# Altium schematic sheet Sheet2.SchDoc: =GlobalProjectName
size 410 x 297 mm; ApprovedBy: Утвердил; CheckedBy: Проверил; Author: Разработал; SheetNumber: 1; SheetTotal: 1; PageSetup: Record=PageOptions|CenterHorizontal=True|CenterVertical=True|PrintScale=1.00|XCorrection=1.00|YCorrection=1.00|PrintKind=1|BorderSize=5000000|LeftOffset=0|BottomOffset=0|Orientation=2|PaperLength=1000|PaperWidth=1000|Scale=100|PaperSource=15|PrintQuality=1200|MediaType=1|DitherType=10|PaperKind=A3|PrintScaleMode=1; Weight: -; ScaleFactor: -; NormInspection: Норм.Контр.
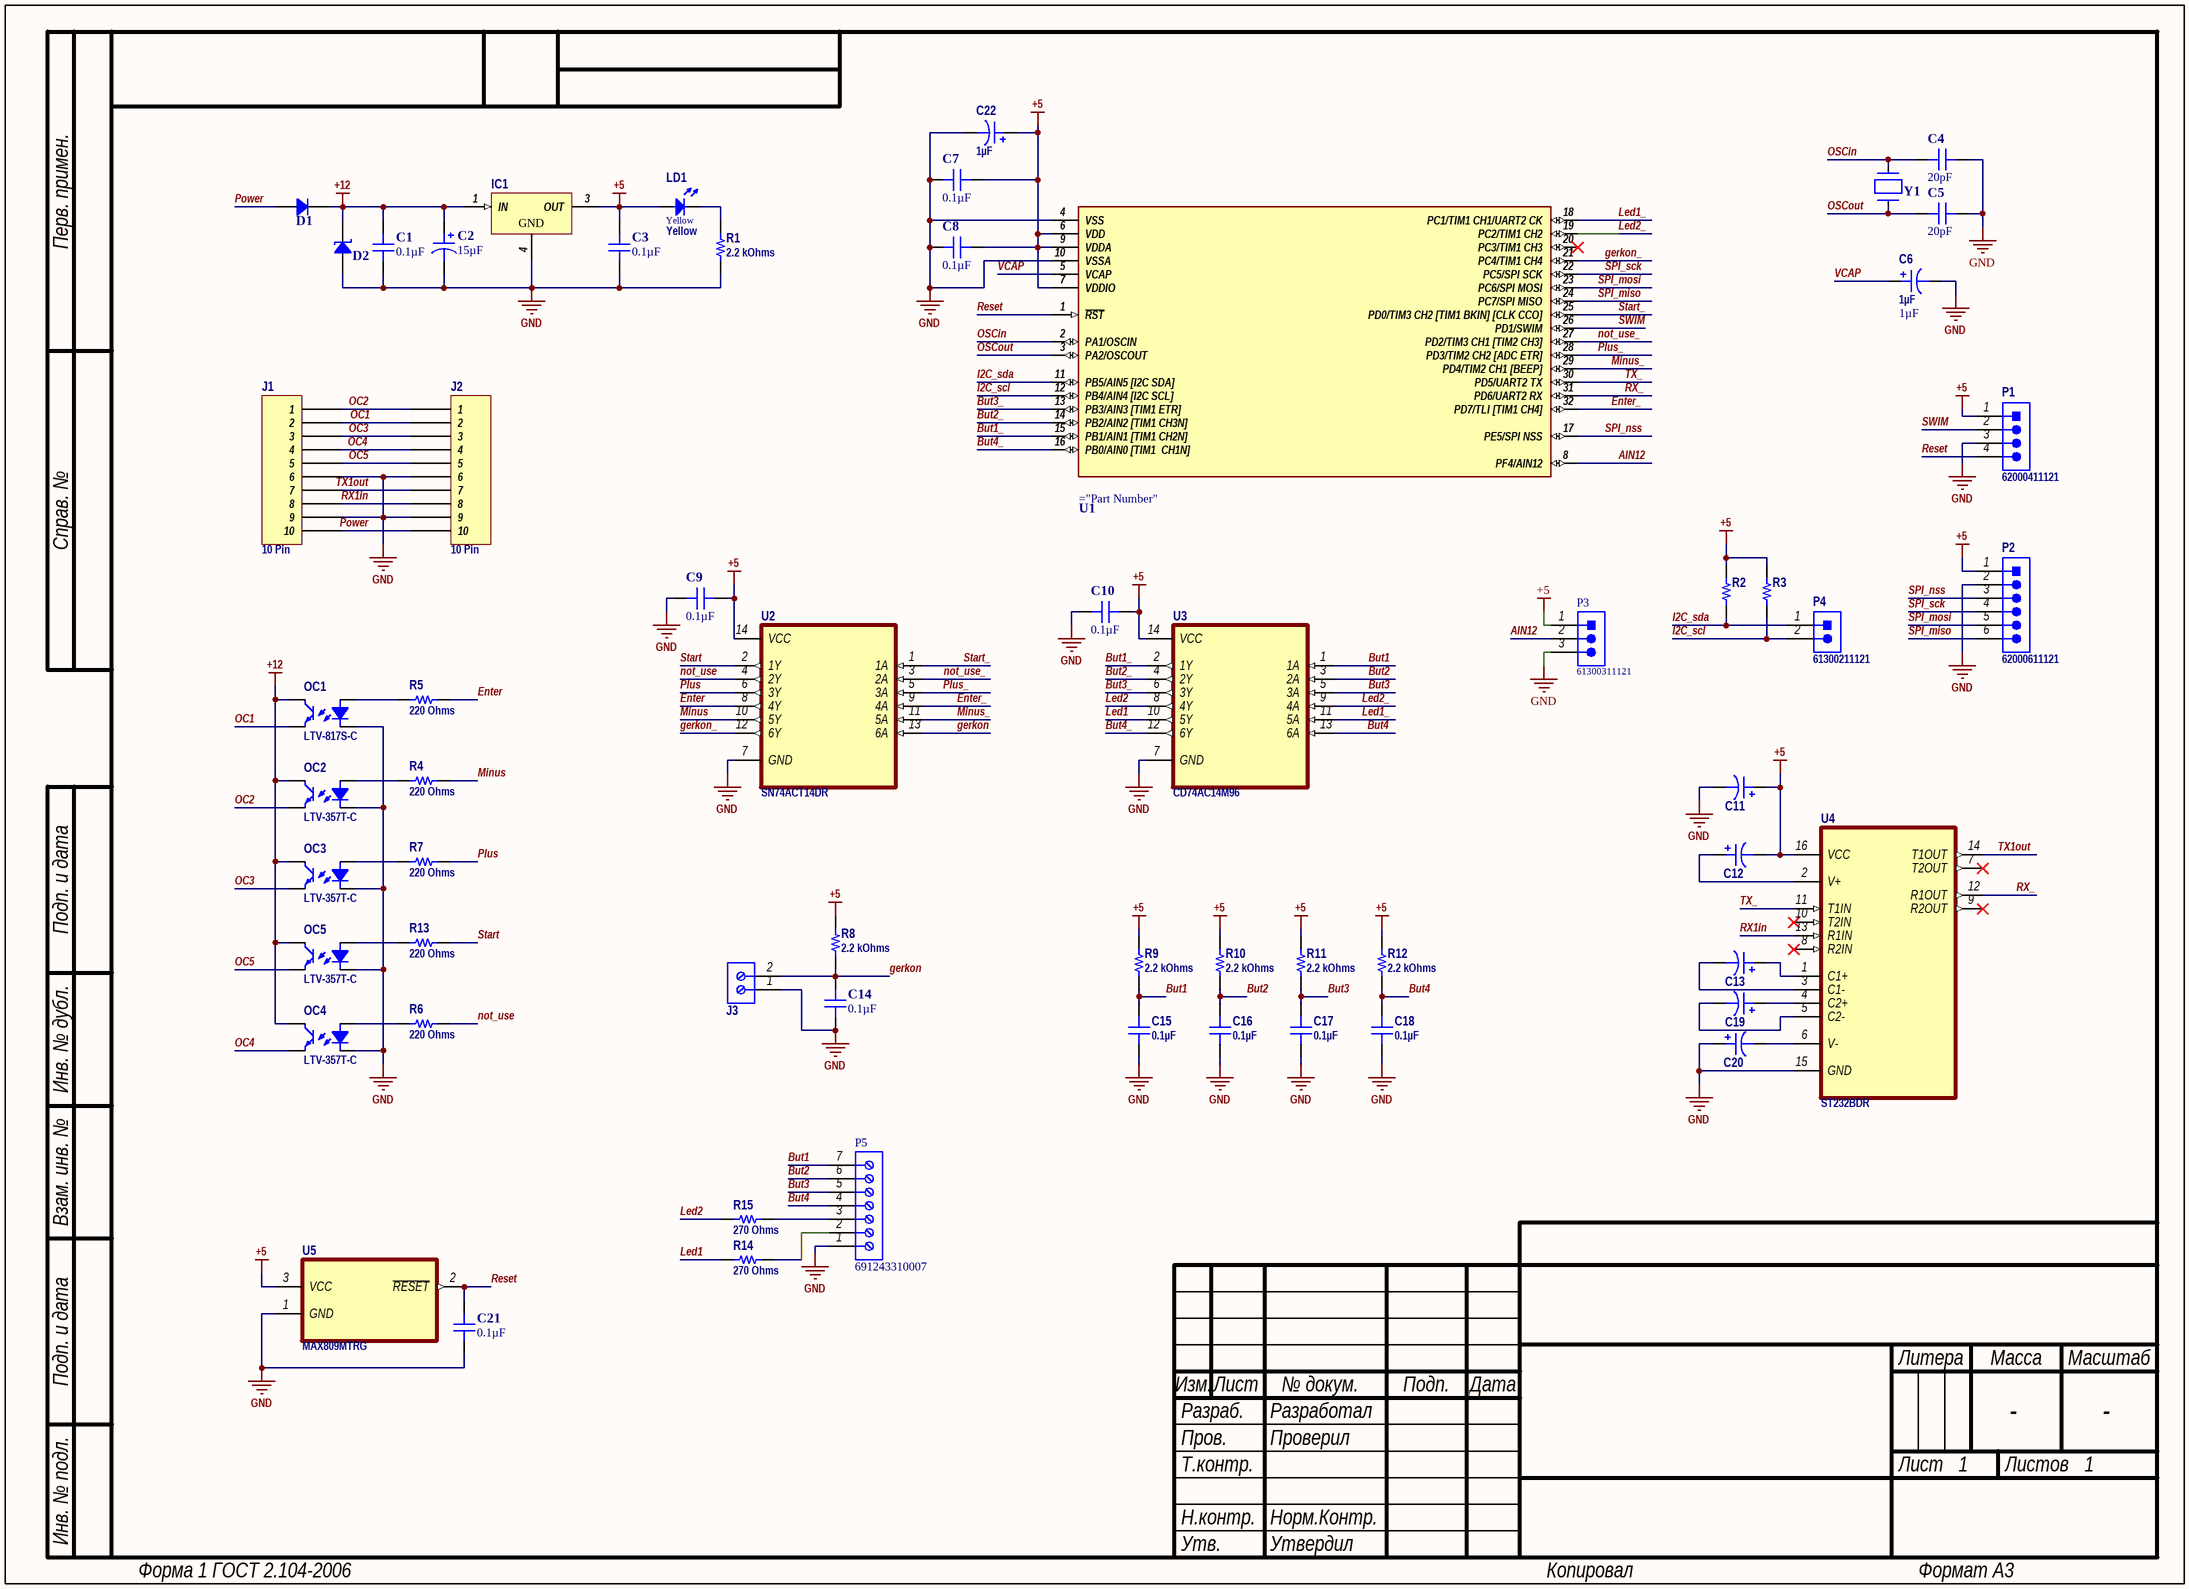
[diagram p0: Sheet2.SchDoc]

## Parts
C1  0.1µF  [CAP 0603_1608]
C2  15µF  [CAP POL 2917_7343]
C3  0.1µF  [CAP 0603_1608]
C4  20pF  [CAP 0603_1608]
C5  20pF  [CAP 0603_1608]
C6  1µF  [CAP POL 1206_3216]
C7  0.1µF  [CAP 0603_1608]
C8  0.1µF  [CAP 0603_1608]
C9  0.1µF  [CAP 0603_1608]
C10  0.1µF  [CAP 0603_1608]
C11  0.47µF  [CAP POL 1206_3216]  (value not drawn)
C12  0.47µF  [CAP POL 1206_3216]  (value not drawn)
C13  0.47µF  [CAP POL 1206_3216]  (value not drawn)
C14  0.1µF  [CAP 0603_1608]
C15  0.1µF  [CAP 0402_1005]
C16  0.1µF  [CAP 0402_1005]
C17  0.1µF  [CAP 0402_1005]
C18  0.1µF  [CAP 0402_1005]
C19  0.47µF  [CAP POL 1206_3216]  (value not drawn)
C20  0.47µF  [CAP POL 1206_3216]  (value not drawn)
C21  0.1µF  [CAP 0603_1608]
C22  1µF  [CAP POL 1206_3216]
D1  SS24FL  [SOD-123W]  (value not drawn)
D2  SMBJ15CA-E3/52  [DO214AA SMB]  (value not drawn)
IC1  MC7805BDTG  [TO-252AA]  (value not drawn)
J1  10 Pin  [CON: IDC-10MS - 1_7mm]
J2  10 Pin  [CON: IDC-10MS - 1_7mm]
J3  691103110002  [691103110002]  (value not drawn)
LD1  Yellow  [LED_KINGBRIGHT_KPH-1608YC]
OC1  LTV-817S-C  [LITEON LTV-817]
OC2  LTV-357T-C  [LITEON LTV-357T]
OC3  LTV-357T-C  [LITEON LTV-357T]
OC4  LTV-357T-C  [LITEON LTV-357T]
OC5  LTV-357T-C  [LITEON LTV-357T]
P1  62000411121  [62000411121]
P2  62000611121  [62000611121]
P3  61300311121  [61300311121]
P4  61300211121  [61300211121]
P5  691243310007  [691243310007]
R1  2.2 kOhms  [RES 0603_1608]
R2  2.2 kOhms  [RES 0603_1608]  (value not drawn)
R3  2.2 kOhms  [RES 0603_1608]  (value not drawn)
R4  220 Ohms  [RES 0603_1608]
R5  220 Ohms  [RES 0603_1608]
R6  220 Ohms  [RES 0603_1608]
R7  220 Ohms  [RES 0603_1608]
R8  2.2 kOhms  [RES 0603_1608]
R9  2.2 kOhms  [RES 0603_1608]
R10  2.2 kOhms  [RES 0603_1608]
R11  2.2 kOhms  [RES 0603_1608]
R12  2.2 kOhms  [RES 0603_1608]
R13  220 Ohms  [RES 0603_1608]
R14  270 Ohms  [RES 0805_2012]
R15  270 Ohms  [RES 0805_2012]
U1  STM8S005K6T6C  [STMicroelectronics_LQFP32-5V_0]  (value not drawn)
U2  SN74ACT14DR  [14-SOIC]
U3  CD74AC14M96  [SOIC127P600X175-14N]
U4  ST232BDR  [16-SO]
U5  MAX809MTRG  [SOT95P240X111-3N]
Y1  Crys_Abracon_ABL-16.000MHZ-B2_eec  [Abracon_ABL-16.000MHZ-B2_0]  (value not drawn)

## Nets
+5: C3.2 C7.2 C8.1 C9.1 C10.1 C11.1 C12.2 C22.1 IC1.3(OUT) LD1.2(A) P1.1 P2.1 P3.1 R2.2 R3.2 R8.2 R9.2 R10.2 R11.2 R12.2 U1.6(VDD) U1.7(VDDIO) U1.9(VDDA) U2.14(VCC) U3.14(VCC) U4.16(VCC) U5.3(VCC)
+12: C1.2 C2.1 D1.2 D2.2 IC1.1(IN) OC1.4 OC2.4 OC3.4 OC4.4 OC5.4
GND: C1.1 C2.2 C3.1 C4.1 C5.1 C6.2 C7.1 C8.2 C9.2 C10.2 C11.2 C14.1 C15.1 C16.1 C17.1 C18.1 C20.1 C21.1 C22.2 D2.1 IC1.4(GND) J1.6 J1.9 J2.6 J2.9 J3.1 OC1.2 OC2.2 OC3.2 OC4.2 OC5.2 P1.3 P2.2 P3.3 P5.1 R1.1 U1.4(VSS) U1.10(VSSA) U2.7(GND) U3.7(GND) U4.15(GND) U5.1(GND)
AIN12: P3.2 U1.8(PF4/AIN12)
But1: C15.2 P5.7 R9.1 U3.1(1A)
But1_: U1.15(PB1/AIN1_[TIM1_CH2N]) U3.2(1Y)
But2: C16.2 P5.6 R10.1 U3.3(2A)
But2_: U1.14(PB2/AIN2_[TIM1_CH3N]) U3.4(2Y)
But3: C17.2 P5.5 R11.1 U3.5(3A)
But3_: U1.13(PB3/AIN3_[TIM1_ETR]) U3.6(3Y)
But4: C18.2 P5.4 R12.1 U3.13(6A)
But4_: U1.16(PB0/AIN0_[TIM1__CH1N]) U3.12(6Y)
Enter: R5.2 U2.8(4Y)
Enter_: U1.32(PD7/TLI_[TIM1_CH4]) U2.9(4A)
gerkon: C14.2 J3.2 R8.1 U2.13(6A)
gerkon_: U1.21(PC4/TIM1_CH4) U2.12(6Y)
I2C_scl: P4.2 R3.1 U1.12(PB4/AIN4_[I2C_SCL])
I2C_sda: P4.1 R2.1 U1.11(PB5/AIN5_[I2C_SDA])
Led1: R14.1 U3.10(5Y)
Led1_: U1.18(PC1/TIM1_CH1/UART2_CK) U3.11(5A)
Led2: R15.1 U3.8(4Y)
Led2_: U1.19(PC2/TIM1_CH2) U3.9(4A)
Minus: R4.2 U2.10(5Y)
Minus_: U1.29(PD4/TIM2_CH1_[BEEP]) U2.11(5A)
not_use: R6.2 U2.4(2Y)
not_use_: U1.27(PD2/TIM3_CH1_[TIM2_CH3]) U2.3(2A)
OC1: J1.2 J2.2 OC1.3
OC2: J1.1 J2.1 OC2.3
OC3: J1.3 J2.3 OC3.3
OC4: J1.4 J2.4 OC4.3
OC5: J1.5 J2.5 OC5.3
OSCin: C4.2 U1.2(PA1/OSCIN) Y1.1
OSCout: C5.2 U1.3(PA2/OSCOUT) Y1.2
Plus: R7.2 U2.6(3Y)
Plus_: U1.28(PD3/TIM2_CH2_[ADC_ETR]) U2.5(3A)
Power: D1.1 J1.10 J2.10
Reset: C21.2 P1.4 U1.1(~{RST}) U5.2(~{RESET})
RX1in: J1.8 J2.8 U4.13(R1IN)
RX_: U1.31(PD6/UART2_RX) U4.12(R1OUT)
SPI_miso: P2.6 U1.24(PC7/SPI_MISO)
SPI_mosi: P2.5 U1.23(PC6/SPI_MOSI)
SPI_nss: P2.3 U1.17(PE5/SPI_NSS)
SPI_sck: P2.4 U1.22(PC5/SPI_SCK)
Start: R13.2 U2.2(1Y)
Start_: U1.25(PD0/TIM3_CH2_[TIM1_BKIN]_[CLK_CCO]) U2.1(1A)
SWIM: P1.2 U1.26(PD1/SWIM)
TX1out: J1.7 J2.7 U4.14(T1OUT)
TX_: U1.30(PD5/UART2_TX) U4.11(T1IN)
VCAP: C6.1 U1.5(VCAP)
NetC12_1: C12.1 U4.2(V+)
NetC13_1: C13.1 U4.1(C1+)
NetC13_2: C13.2 U4.3(C1-)
NetC19_1: C19.1 U4.4(C2+)
NetC19_2: C19.2 U4.5(C2-)
NetC20_2: C20.2 U4.6(V-)
NetLD1_1: LD1.1(C) R1.2
NetOC1_1: OC1.1 R5.1
NetOC2_1: OC2.1 R4.1
NetOC3_1: OC3.1 R7.1
NetOC4_1: OC4.1 R6.1
NetOC5_1: OC5.1 R13.1
NetP5_2: P5.2 R14.2
NetP5_3: P5.3 R15.2

Not connected (* = marked no-connect by the designer): U1 20(PC3/TIM1_CH3)*; U4 7(T2OUT)* 8(R2IN)* 9(R2OUT)* 10(T2IN)*

## Notes on the sheet
- Перв. примен.
- Справ. №
- Подп. и дата
- Инв. № дубл.
- Взам. инв. №
- Разраб.
- Изм.
- Лист
- № докум.
- Подп.
- Дата
- Литера
- Масса
- Масштаб
- Пров.
- Т.контр.
- Листов
- Инв. № подл.
- Н.контр.
- Утв.
- Форма 1 ГОСТ 2.104-2006
- Копировал
- Формат А3

## Library data of the parts
C1 C3 C7-C10 C14 C21 = CC0603KRX5R9BB104: CAP CER 0.1UF 50V X5R 0603; Manufacturer: Yageo; Tolerance: ±10%; Part Number: CC0603KRX5R9BB104; Value: 0.1µF; Applications: General Purpose; Capacitance: 0.1µF; ComponentLink1Description: Datasheet; ComponentLink1URL: https://www.yageo.com/upload/media/product/productsearch/datasheet/mlcc/UPY-GPHC_X5R_4V-to-50V_25.pdf; ComponentLink2Description: DigiKey Link; ComponentLink2URL: http://digikey.com/product-detail/en/yageo/CC0603KRX5R9BB104/311-4046-1-ND/8025135; Device Package: 0603 (1608 Metric); LastUpdated: 02.09.2020 1:03:08; Lifecycle Status: Active; Minimum Order: 1; Mounting Type: Surface Mount, MLCC; Operating Temperature: -55°C ~ 85°C; Package / Case: 0603 (1608 Metric); Packaging: TapeAndReel; PartId: 15794; Part Status: Active; Price: 0.01; Series: CC; Size / Dimension: 0.063" L x 0.031" W (1.60mm x 0.80mm); Supplier 1: DigiKey; Supplier Part Number 1: 311-4046-1-ND; Temperature Coefficient: X5R; Thickness (Max): 0.035" (0.90mm); Voltage - Rated: 50V
C2 = 593D156X9035D2TE3: CAP TANT 15UF 10% 35V 2917; Manufacturer: Vishay Sprague; Manufacturer Size Code: D; ESR (Equivalent Series Resistance): 300mOhm; Type: Molded; Part Number: 593D156X9035D2TE3; Value: 15µF; Capacitance: 15µF; ComponentLink1Description: Datasheet; ComponentLink1URL: http://www.vishay.com/docs/40005/593d.pdf; ComponentLink2Description: DigiKey Link; ComponentLink2URL: http://digikey.com/product-detail/en/vishay-sprague/593D156X9035D2TE3/718-1103-1-ND/1559597; Device Package: 2917 (7343 Metric); Features: General Purpose; Height - Seated (Max): 0.122" (3.10mm); LastUpdated: 02.09.2020 1:16:12; Lifecycle Status: Active; Minimum Order: 1; Mounting Type: Surface Mount; Operating Temperature: -55°C ~ 125°C; Package / Case: 2917 (7343 Metric); Packaging: TapeAndReel; PartId: 3227; Part Status: Active; Price: 0.38; Series: TANTAMOUNT®, 593D; Size / Dimension: 0.287" L x 0.169" W (7.30mm x 4.30mm); Supplier 1: DigiKey; Supplier Part Number 1: 718-1103-1-ND; Tolerance: ±10%; Voltage - Rated: 35V
C4 C5 = CC0603JRNPO9BN200: CAP CER 20PF 50V C0G/NPO 0603; Manufacturer: Yageo; Temperature Coefficient: C0G, NP0; Tolerance: ±5%; Part Number: CC0603JRNPO9BN200; Value: 20pF; Applications: General Purpose; Capacitance: 20pF; ComponentLink1Description: Datasheet; ComponentLink1URL: https://www.yageo.com/upload/media/product/productsearch/datasheet/mlcc/UPY-GP_NP0_16V-to-50V_17.pdf; ComponentLink2Description: DigiKey Link; ComponentLink2URL: http://digikey.com/product-detail/en/yageo/CC0603JRNPO9BN200/311-1424-1-ND/2833730; Device Package: 0603 (1608 Metric); LastUpdated: 02.09.2020 1:03:05; Lifecycle Status: Active; Minimum Order: 1; Mounting Type: Surface Mount, MLCC; Operating Temperature: -55°C ~ 125°C; Package / Case: 0603 (1608 Metric); Packaging: TapeAndReel; PartId: 16728; Part Status: Active; Price: 0.01; Series: CC; Size / Dimension: 0.063" L x 0.031" W (1.60mm x 0.80mm); Supplier 1: DigiKey; Supplier Part Number 1: 311-1424-1-ND; Thickness (Max): 0.035" (0.90mm); Voltage - Rated: 50V
C6 C22 = 293D105X9020A2TE3: CAP TANT 1UF 10% 20V 1206; Manufacturer: Vishay Sprague; Manufacturer Size Code: A; ESR (Equivalent Series Resistance): 8.4Ohm; Type: Molded; Part Number: 293D105X9020A2TE3; Value: 1µF; Capacitance: 1µF; ComponentLink1Description: Datasheet; ComponentLink1URL: http://www.vishay.com/docs/40002/293d.pdf; ComponentLink2Description: DigiKey Link; ComponentLink2URL: http://digikey.com/product-detail/en/vishay-sprague/293D105X9020A2TE3/718-1114-1-ND/1559608; Device Package: 1206 (3216 Metric); Features: General Purpose; Height - Seated (Max): 0.071" (1.80mm); LastUpdated: 02.09.2020 1:15:57; Lifecycle Status: Active; Minimum Order: 1; Mounting Type: Surface Mount; Operating Temperature: -55°C ~ 125°C; Package / Case: 1206 (3216 Metric); Packaging: TapeAndReel; PartId: 822; Part Status: Active; Price: 0.11; Series: TANTAMOUNT®, 293D; Size / Dimension: 0.126" L x 0.063" W (3.20mm x 1.60mm); Supplier 1: DigiKey; Supplier Part Number 1: 718-1114-1-ND; Tolerance: ±10%; Voltage - Rated: 20V
C11-C13 C19 C20 = 293D474X9035A2TE3: CAP TANT 0.47UF 10% 35V 1206; Manufacturer: Vishay Sprague; Manufacturer Size Code: A; ESR (Equivalent Series Resistance): 10Ohm; Type: Molded; Part Number: 293D474X9035A2TE3; Value: 0.47µF; Capacitance: 0.47µF; ComponentLink1Description: Datasheet; ComponentLink1URL: http://www.vishay.com/docs/40002/293d.pdf; ComponentLink2Description: DigiKey Link; ComponentLink2URL: http://digikey.com/product-detail/en/vishay-sprague/293D474X9035A2TE3/718-1808-1-ND/2259950; Device Package: 1206 (3216 Metric); Features: General Purpose; Height - Seated (Max): 0.071" (1.80mm); LastUpdated: 02.09.2020 1:15:57; Lifecycle Status: Active; Minimum Order: 1; Mounting Type: Surface Mount; Operating Temperature: -55°C ~ 125°C; Package / Case: 1206 (3216 Metric); Packaging: TapeAndReel; PartId: 592; Part Status: Active; Price: 0.12; Series: TANTAMOUNT®, 293D; Size / Dimension: 0.126" L x 0.063" W (3.20mm x 1.60mm); Supplier 1: DigiKey; Supplier Part Number 1: 718-1808-1-ND; Tolerance: ±10%; Voltage - Rated: 35V
C15-C18 = CGA2B2X5R1A104K050BA: CAP CER 0.1UF 10V X5R 0402; Manufacturer: TDK Corporation; Tolerance: ±10%; Part Number: CGA2B2X5R1A104K050BA; Value: 0.1µF; Applications: Automotive; Capacitance: 0.1µF; ComponentLink1Description: Datasheet; ComponentLink1URL: https://product.tdk.com/info/en/catalog/datasheets/mlcc_automotive_general_en.pdf?ref_disty=digikey; ComponentLink2Description: DigiKey Link; ComponentLink2URL: http://digikey.com/product-detail/en/tdk-corporation/CGA2B2X5R1A104K050BA/445-12156-1-ND/3953822; Device Package: 0402 (1005 Metric); LastUpdated: 02.09.2020 1:02:21; Lifecycle Status: Active; Minimum Order: 1; Mounting Type: Surface Mount, MLCC; Operating Temperature: -55°C ~ 85°C; Package / Case: 0402 (1005 Metric); Packaging: TapeAndReel; PartId: 3289; Part Status: Active; Price: 0.01; Ratings: AEC-Q200; Series: CGA; Size / Dimension: 0.039" L x 0.020" W (1.00mm x 0.50mm); Supplier 1: DigiKey; Supplier Part Number 1: 445-12156-1-ND; Temperature Coefficient: X5R; Thickness (Max): 0.022" (0.55mm); Voltage - Rated: 10V
D1 = Diode: Rectifier Diode
D2 = DIODE TVS UNI: Rectifier Diode
IC1 = REG3 1IN-2GND-3OUT: 3-Terminal Regulator 1=IN 2=GND 3=OUT
J3 = 691103110002: WR-TBL Serie 1031 Horizontal Entry Modular, Pressure Clamp, THT, pitch 3.5mm, 2p; Manufacturer: Wurth Elektronik; Modularity: Yes; PCB/Cable/Panel: PCB; Pin Number: 2; Rated Current [UL]: 10A; Working Voltage [UL]: 125VAC; ComponentLink1Description: Manufacturer; ComponentLink1URL: http://www.we-online.de; ComponentLink2URL: https://katalog.we-online.de/em/datasheet/691103110002.pdf; ComponentLink2Description: Datasheet; Mounting Technology: THT; Manufacturer Part Number: 691103110002; Packaging: Box; Operating Temperature: -40 to +105degC; Pitch: 3.5mm; Published Date: Feburary 2021; Type: Horizontal; Application: Pressure Clamp
LD1 = LED_KINGBRIGHT_KPH-1608YC: LED Yellow 1C 2A; Part Description: SMD Yellow LED, Case 1.6mmX0.8mm(0603), 0.65mm Thickness; PressFit: No; Bonding: No; Part Number: LED_KINGBRIGHT_KPH-1608YC; Component Kind: Standard; Component Type: Standard; Color: Yellow; PackageDescription: SMT Yellow LED, Case 0603, Body L 1.6 x W 0.8mm H 0.65mm; Manufacturer: KINGBRIGHT; Manufacturer Part Number: KPH-1608YC; Pin Count: 2; Mounted: Yes; Socket: No; SMD: Yes; Sense: No; ComponentHeight: 0.65mm; HelpURL: \\cern.ch\dfs\Applications\Altium\Datasheets\LED_KINGBRIGHT_KPH-1608YC.pdf; Author: CERN DEM JLC; CreateDate: 03.07.2017; LatestRevisionDate: 03.07.2017
OC1 = Optoisolator
OC2-OC5 = Optoisolator_1
P1 = 62000411121: WR-PHD Pin Header, THT, pitch 2mm, Single Row, Vertical, 4p; Manufacturer: Wurth Elektronik; Pin Number: 4; Rated Current: 2A; Working Voltage: 200VAC; Withstanding Voltage: 500VAC; Contact Resistance: 20mOhm; ComponentLink1Description: Manufacturer; ComponentLink1URL: http://www.we-online.de; ComponentLink2Description: Datasheet; ComponentLink2URL: https://www.we-online.com/catalog/datasheet/62000411121.pdf; Manufacturer Part Number: 62000411121; Pitch: 2mm; Operating Temperature: -40 to +105degC; Mounting Technology: THT; Packaging: Bag; Gender: Pin Header; Row Number: Single; Orientation: Vertical
P2 = 62000611121: WR-PHD Pin Header, THT, pitch 2mm, Single Row, Vertical, 6p; Manufacturer: Wurth Elektronik; Pin Number: 6; Rated Current: 2A; Working Voltage: 200VAC; Withstanding Voltage: 500VAC; Contact Resistance: 20mOhm; ComponentLink1Description: Manufacturer; ComponentLink1URL: http://www.we-online.de; ComponentLink2Description: Datasheet; ComponentLink2URL: https://www.we-online.com/catalog/datasheet/62000611121.pdf; Manufacturer Part Number: 62000611121; Pitch: 2mm; Operating Temperature: -40 to +105degC; Mounting Technology: THT; Packaging: Bag; Gender: Pin Header; Row Number: Single; Orientation: Vertical
P3 = 61300311121: WR-PHD Pin Header, THT, pitch 2.54mm, Single Row, Vertical, 3p; Manufacturer: Wurth Elektronik; Pin Number: 3; Rated Current: 3A; Working Voltage: 250VAC; Withstanding Voltage: 500VAC; Contact Resistance: 20mOhm; ComponentLink1Description: Manufacturer; ComponentLink1URL: http://www.we-online.de; ComponentLink2Description: Datasheet; ComponentLink2URL: https://www.we-online.com/catalog/datasheet/61300311121.pdf; Manufacturer Part Number: 61300311121; Pitch: 2.54mm; Operating Temperature: -40 to +105degC; Mounting Technology: THT; Packaging: Bag; Gender: Pin Header; Row Number: Single; Orientation: Vertical
P4 = 61300211121: WR-PHD Pin Header, THT, pitch 2.54mm, Single Row, Vertical, 2p; Manufacturer: Wurth Elektronik; Pin Number: 2; Rated Current: 3A; Working Voltage: 250VAC; Withstanding Voltage: 500VAC; Contact Resistance: 20mOhm; ComponentLink1Description: Manufacturer; ComponentLink1URL: http://www.we-online.de; ComponentLink2Description: Datasheet; ComponentLink2URL: https://www.we-online.com/catalog/datasheet/61300211121.pdf; Manufacturer Part Number: 61300211121; Pitch: 2.54mm; Operating Temperature: -40 to +105degC; Mounting Technology: THT; Packaging: Bag; Gender: Pin Header; Row Number: Single; Orientation: Vertical
P5 = 691243310007: WR-TBL Serie 2433 Horizontal Entry Modular, Rising Cage Clamp, THT, pitch 3.81mm, 7p; Manufacturer: Wurth Elektronik; Modularity: No; PCB/Cable/Panel: PCB; Pin Number: 7; Rated Current [UL]: 10A; Working Voltage [UL]: 300VAC; ComponentLink1Description: Manufacturer; ComponentLink1URL: http://www.we-online.de; ComponentLink2URL: https://katalog.we-online.de/em/datasheet/691243310007.pdf; ComponentLink2Description: Datasheet; Mounting Technology: THT; Manufacturer Part Number: 691243310007; Packaging: Box; Operating Temperature: -30 to +120degC; Pitch: 3.81mm; Published Date: Feburary 2021; Type: Horizontal; Application: Rising Cage Clamp
R1-R3 R8-R12 = RC0603JR-072K2L: RES SMD 2.2K OHM 5% 1/10W 0603; Manufacturer: Yageo; Power (Watts): 0.1W, 1/10W; Temperature Coefficient: ±100ppm/°C; Part Number: RC0603JR-072K2L; Value: 2.2 kOhms; ComponentLink1Description: Datasheet; ComponentLink1URL: https://www.yageo.com/upload/media/product/productsearch/datasheet/rchip/PYu-RC_Group_51_RoHS_L_10.pdf; ComponentLink2Description: DigiKey Link; ComponentLink2URL: http://digikey.com/product-detail/en/yageo/RC0603JR-072K2L/311-2.2KGRCT-ND/729676; Composition: Thick Film; Device Package: 0603 (1608 Metric); Features: Moisture Resistant; Height - Seated (Max): 0.022" (0.55mm); LastUpdated: 02.09.2020 1:09:59; Lifecycle Status: Active; Minimum Order: 1; Number of Terminations: 2; Operating Temperature: -55°C ~ 155°C; Package / Case: 0603 (1608 Metric); Packaging: CutTape; PartId: 17075; Part Status: Active; Price: 0.10; Resistance: 2.2 kOhms; Series: RC; Size / Dimension: 0.063" L x 0.031" W (1.60mm x 0.80mm); Supplier 1: DigiKey; Supplier Part Number 1: 311-2.2KGRCT-ND; Supplier Device Package: 0603; Tolerance: ±5%
R4-R7 R13 = AC0603JR-07220RL: RES SMD 220 OHM 5% 1/10W 0603; Manufacturer: Yageo; Power (Watts): 0.1W, 1/10W; Temperature Coefficient: ±100ppm/°C; Part Number: AC0603JR-07220RL; Value: 220 Ohms; ComponentLink1Description: Datasheet; ComponentLink1URL: https://www.yageo.com/upload/media/product/productsearch/datasheet/rchip/PYu-AC_51_RoHS_L_7.pdf; ComponentLink2Description: DigiKey Link; ComponentLink2URL: http://digikey.com/product-detail/en/yageo/AC0603JR-07220RL/YAG3652CT-ND/6006501; Composition: Thick Film; Device Package: 0603 (1608 Metric); Features: Automotive AEC-Q200, Moisture Resistant; Height - Seated (Max): 0.022" (0.55mm); LastUpdated: 02.09.2020 1:10:02; Lifecycle Status: Active; Minimum Order: 1; Number of Terminations: 2; Operating Temperature: -55°C ~ 155°C; Package / Case: 0603 (1608 Metric); Packaging: CutTape; PartId: 15757; Part Status: Active; Price: 0.10; Ratings: AEC-Q200; Resistance: 220 Ohms; Series: AC; Size / Dimension: 0.063" L x 0.031" W (1.60mm x 0.80mm); Supplier 1: DigiKey; Supplier Part Number 1: YAG3652CT-ND; Supplier Device Package: 0603; Tolerance: ±5%
R14 R15 = RC0805JR-07270RL: RES SMD 270 OHM 5% 1/8W 0805; Manufacturer: Yageo; Power (Watts): 0.125W, 1/8W; Temperature Coefficient: ±100ppm/°C; Part Number: RC0805JR-07270RL; Value: 270 Ohms; ComponentLink1Description: Datasheet; ComponentLink1URL: https://www.yageo.com/upload/media/product/productsearch/datasheet/rchip/PYu-RC_Group_51_RoHS_L_10.pdf; ComponentLink2Description: DigiKey Link; ComponentLink2URL: http://digikey.com/product-detail/en/yageo/RC0805JR-07270RL/311-270ARCT-ND/731238; Composition: Thick Film; Device Package: 0805 (2012 Metric); Features: Moisture Resistant; Height - Seated (Max): 0.024" (0.60mm); LastUpdated: 02.09.2020 1:14:53; Lifecycle Status: Active; Minimum Order: 1; Number of Terminations: 2; Operating Temperature: -55°C ~ 155°C; Package / Case: 0805 (2012 Metric); Packaging: CutTape; PartId: 41820; Part Status: Active; Price: 0.10; Resistance: 270 Ohms; Series: RC; Size / Dimension: 0.079" L x 0.049" W (2.00mm x 1.25mm); Supplier 1: DigiKey; Supplier Part Number 1: 311-270ARCT-ND; Supplier Device Package: 0805; Tolerance: ±5%
U3 = CD74AC14M96: Hex Schmitt-Triggered Inverters 14-SOIC -55 to 125; MF: Texas Instruments; Value: *; Package: SOIC-14 Texas Instruments; Availability: In Stock; Check_prices: https://www.snapeda.com/parts/CD74AC14M96/Texas+Instruments/view-part/?ref=eda; SnapEDA_Link: https://www.snapeda.com/parts/CD74AC14M96/Texas+Instruments/view-part/?ref=snap; Purchase-URL: https://pricing.snapeda.com/search/part/CD74AC14M96/?ref=eda; MP: CD74AC14M96; Price: None
U4 = ST232BDR: 2/2 Transceiver Full RS232 16-SO; MF: STMicroelectronics; SnapEDA_Link: https://www.snapeda.com/parts/ST232BDR/STMicroelectronics/view-part/87836/?ref=snap; Value: *; Price: None; Availability: Unavailable; MP: ST232BDR; Package: SOIC-16 STMicroelectronics
U5 = MAX809TTRG: Supervisor Push-Pull, Totem Pole 1 Channel SOT-23-3 (TO-236); MF: ON Semiconductor; Availability: Unavailable; Package: SOT-23-3 ON Semiconductor; Price: None; SnapEDA_Link: https://www.snapeda.com/parts/MAX809TTRG/ON%20Semiconductor/view-part/47418/?ref=snap; Value: *; MP: MAX809TTRG; Check_prices: https://www.snapeda.com/parts/MAX809TTRG/ON%20Semiconductor/view-part/47418/?ref=eda
Y1 = Crys_Abracon_ABL-16.000MHZ-B2_eec: CRYS 16MHz ±20ppm Crystal 18pF 40 Ohm -20°C ~ 70°C Through Hole HC49/US; Frequency Stability: ±50ppm; ESR: 40 Ohm; Operating Mode: Fundamental; Part Number: ABL-16.000MHZ-B2; helpURL: https://upverter.com/upn/revision/7ebf07e1da2eb130/; ComponentLink2Description: Datasheet; Temperature: 0ºC to +70ºC; Package: HC/49US; Supplier 2: Mouser; Price: 0.175999999027; Supplier 1: Digi-Key; ComponentLink1URL: https://upverter.com/upn/revision/7ebf07e1da2eb130/; Supplier Part Number 2: 815-ABL-16-B2; Supplier Part Number 1: 535-9041-ND; Manufacturer: Abracon; ComponentLink1Description: Upverter; ComponentLink2URL: http://www.abracon.com/Resonators/ABL.pdf; RoHS: TRUE; Mouser Part Number: 815-ABL-16-B2; Frequency Tolerance: ±20ppm; Temperature Range High: +70ºC; Digikey Description: CRYS 16MHz ±20ppm Crystal 18pF 40 Ohm -20°C ~ 70°C Through Hole HC49/US; Digikey Part Number: 535-9041-ND; Lead Free: yes; Temperature Range Low: 0ºC; Load Capacitance: 18pF; Frequency: 16MHz
U2 = SN74ACT14DR: Package: None; Price: None; Value: *; MP: SN74ACT14DR; Availability: Unavailable